# EAGLE design BluetoothAdapter_v2 (EAGLE 8.5.1)
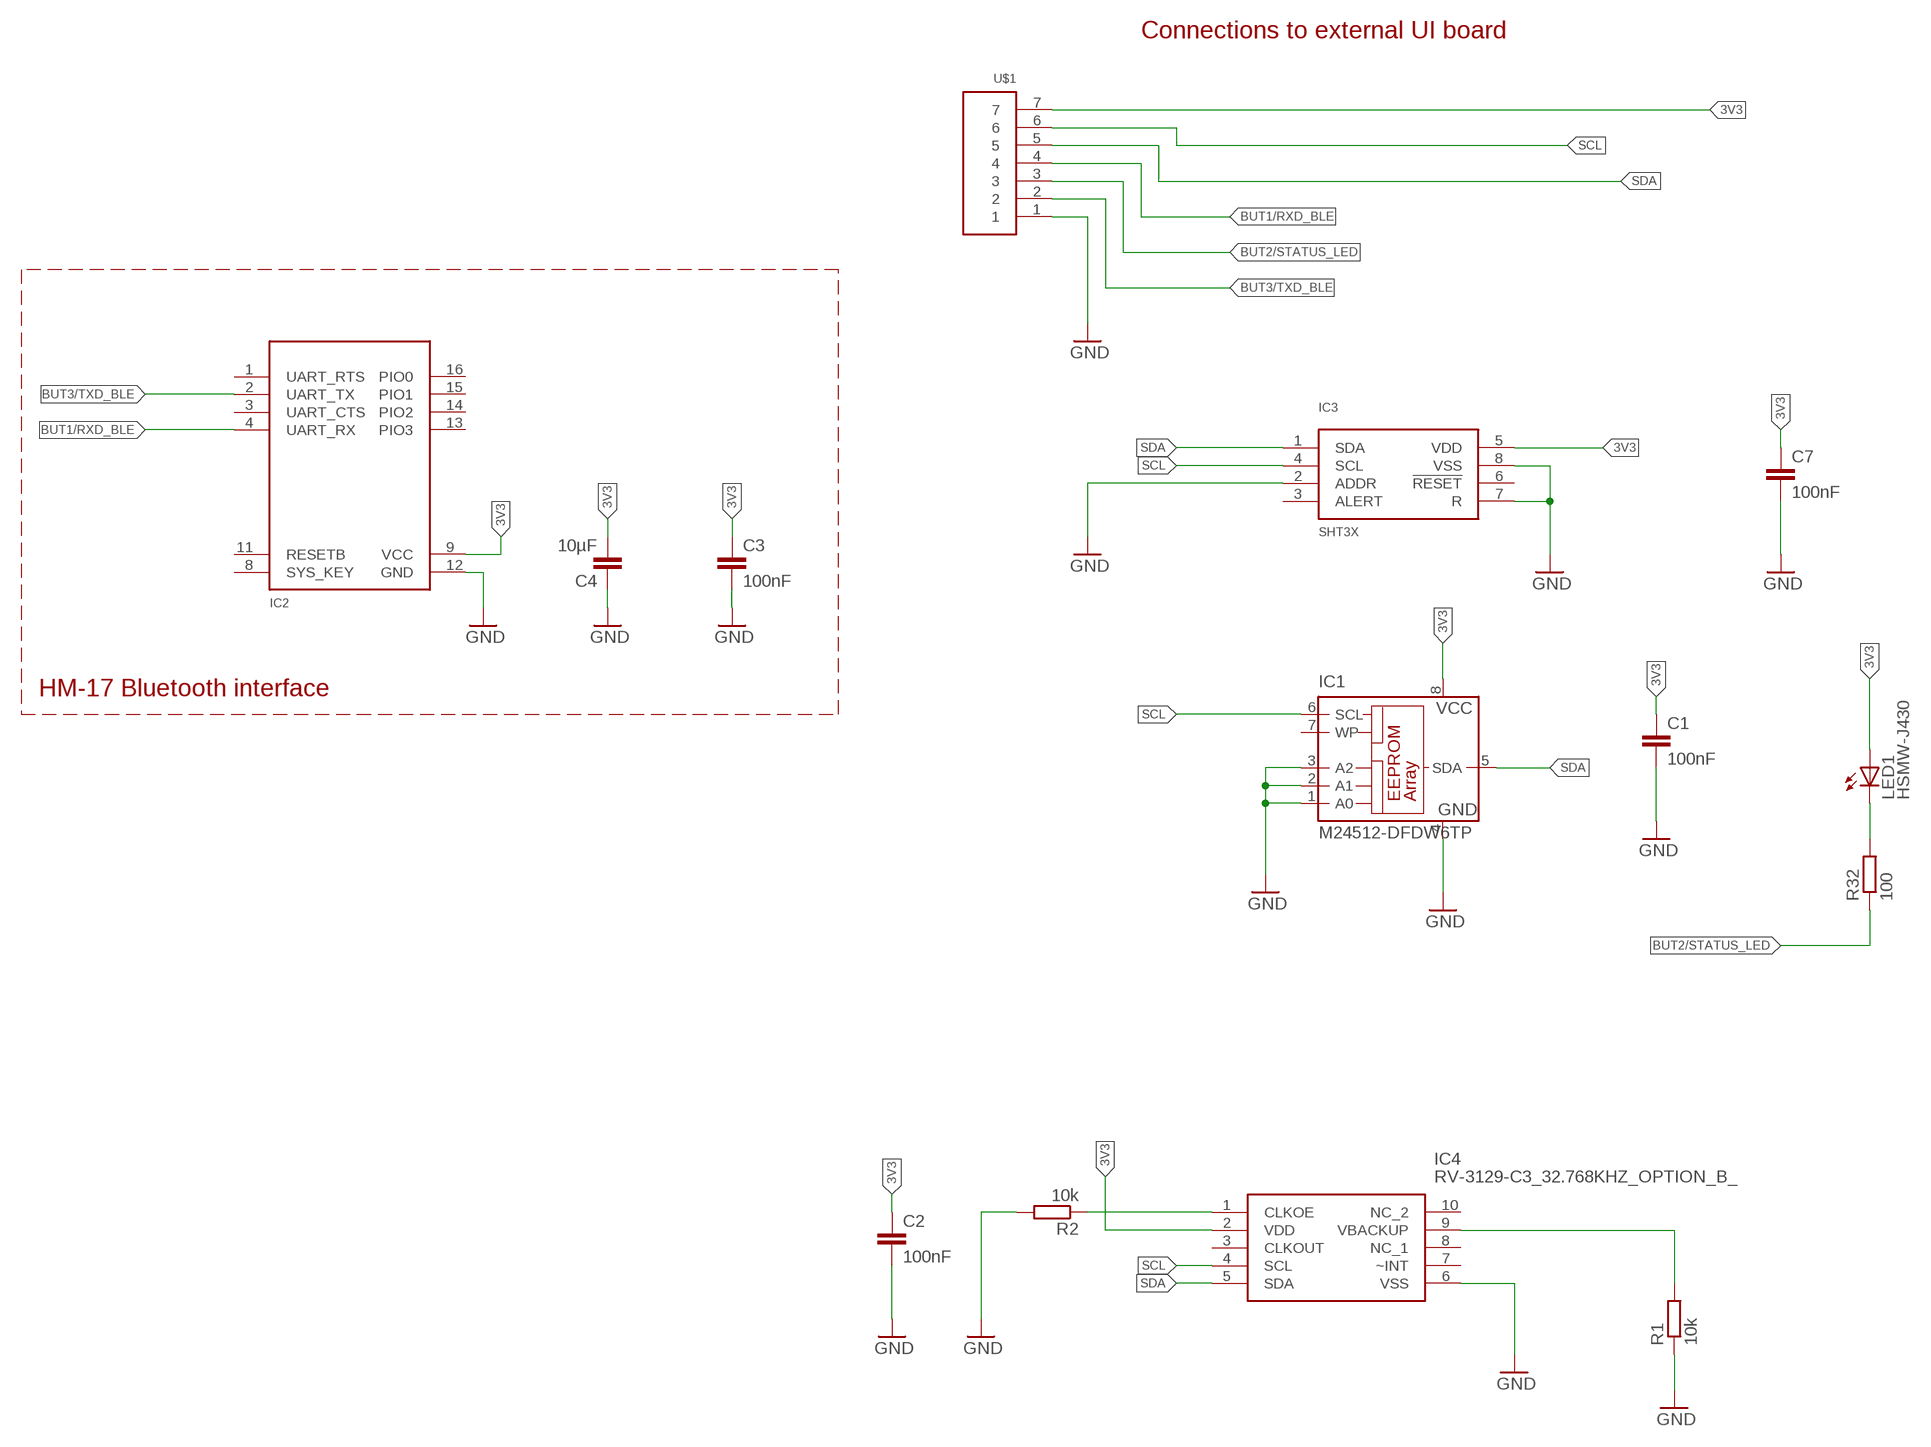
[diagram p0: schematic, sheet 1]

## Parts
C1  100nF  C-EUC0402  [C0402]
C2  100nF  C-EUC0402  [C0402]
C3  100nF  C-EUC0402  [C0402]
C4  10µF  C-EUC0805K  [C0805K]
C7  100nF  C-EUC0402  [C0402]
IC1  M24512-DFDW6TP  24LC128ST  [TSSOP8]
IC2  HM17  [HM17]
IC3  SHT3X  [TDFN8-2.5X2.5MM]
IC4  RV-3129-C3_32.768KHZ_OPTION_B_  [RV3129C3]
LED1  HSMW-J430  LEDSMT1206  [1206]
R1  10k  R-EU_R0603  [R0603]
R2  10k  R-EU_R0603  [R0603]
R32  100  R-EU_R0603  [R0603]
U$1  WIREPAD1X7  [WIREPAD1X7]

## Nets
3V3: C1.1 C2.1 C3.1 C4.2 C7.1 IC1.8(VCC) IC2.9(VCC) IC3.5(VDD) IC4.2(VDD) LED1.A U$1.7
BUT1/RXD_BLE: IC2.4(UART_RX) U$1.4
BUT2/STATUS_LED: R32.1 U$1.3
BUT3/TXD_BLE: IC2.2(UART_TX) U$1.2
GND: C1.2 C2.2 C3.2 C4.1 C7.2 IC1.1(A0) IC1.2(A1) IC1.3(A2) IC1.4(GND) IC2.12(GND) IC3.2(ADDR) IC3.7(R) IC3.8(VSS) IC4.6(VSS) R1.1 R2.2 U$1.1
N$3: IC4.9(VBACKUP) R1.2
N$4: LED1.C R32.2
N$7: IC4.1(CLKOE) R2.1
SCL: IC1.6(SCL) IC3.4(SCL) IC4.4(SCL) U$1.6
SDA: IC1.5(SDA) IC3.1(SDA) IC4.5(SDA) U$1.5
Unconnected: IC1.7(WP) IC2.1(UART_RTS) IC2.3(UART_CTS) IC2.8(SYS_KEY) IC2.11(RESETB) IC2.13(PIO3) IC2.14(PIO2) IC2.15(PIO1) IC2.16(PIO0) IC3.3(ALERT) IC3.6(!RESET) IC4.3(CLKOUT) IC4.7(~INT) IC4.8(NC_1) IC4.10(NC_2)

## Notes on the sheet
- Connections to external UI board
- HM-17 Bluetooth interface

## Library data of the parts
C1-C4 C7 = rcl:C-EU: CAPACITOR, European symbol
IC1 = microchip:24*: Serial EEPROM I2C; MF: MICROCHIP; MPN: 24LC128-I/ST; OC_FARNELL: 1296573; OC_NEWARK: 62K0578
IC2 = HM17Bluetooth:HM17
IC3 = SHT3x:SHT3X
IC4 = SamacSys_Parts:RV-3129-C3_32.768KHZ_OPTION_B_: RV-3129-C3 10-Terminal Ceramic Leadless Chip Carrier [LCC10] Source: Datasheet <https://www.mouser.de/datasheet/2/530/RV_3129_C3-1524928.pdf>; DESCRIPTION: RV-3129-C3 10-Terminal Ceramic Leadless Chip Carrier [LCC10]; HEIGHT: 0.9mm; MANUFACTURER_NAME: Micro Crystal AG; MANUFACTURER_PART_NUMBER: RV-3129-C3 32.768kHz OPTION B TA QC; MOUSER_PART_NUMBER: 428-203634-MG01; MOUSER_PRICE-STOCK: https://www.mouser.co.uk/ProductDetail/Micro-Crystal/RV-3129-C3-32.768kHz-OPTION-B-TA-QC?qs=u16ybLDytRaO5x0LmQ8Ynw%3D%3D
LED1 = led:LED: LED OSRAM: - CHIPLED LG R971, LG N971, LY N971, LG Q971, LY Q971, LO R971, LY R971 LH N974, LH R974 LS Q976, LO Q976, LY Q976 LO Q996 - Hyper CHIPLED LW Q18S LB Q993, LB Q99A, LB R99A - SideLED LS A670, LO A670, LY A670, LG A670, LP A670 LB A673, LV A673, LT A673, LW A673 LH A674 LY A675 LS A676, LA A676, LO A676, LY A676, LW A676 LS A679, LY A679, LG A679 - Hyper Micro SIDELED® LS Y876, LA Y876, LO Y876, LY Y876 LT Y87S - SmartLED LW L88C, LW L88S LB L89C, LB L89S, LG L890 LS L89K, LO L89K, LY L89K LS L896, LA L896, LO L896, LY L896 - TOPLED LS T670, LO T670, LY T670, LG T670, LP T670 LSG T670, LSP T670, LSY T670, LOP T670, LYG T670 LG T671, LOG T671, LSG T671 LB T673, LV T673, LT T673, LW T673 LH T674 LS T676, LA T676, LO T676, LY T676, LB T676, LH T676, LSB T676, LW T676 LB T67C, LV T67C, LT T67C, LS T67K, LO T67K, LY T67K, LW E67C LS E67B, LA E67B, LO E67B, LY E67B, LB E67C, LV E67C, LT E67C LW T67C LS T679, LY T679, LG T679 LS T770, LO T770, LY T770, LG T770, LP T770 LB T773, LV T773, LT T773, LW T773 LH T774 LS E675, LA E675, LY E675, LS T675 LS T776, LA T776, LO T776, LY T776, LB T776 LHGB T686 LT T68C, LB T68C - Hyper Mini TOPLED® LB M676 - Mini TOPLED Santana® LG M470 LS M47K, LO M47K, LY M47K Source: http://www.osram.convergy.de LUXEON: - LUMILED® LXK2-PW12-R00, LXK2-PW12-S00, LXK2-PW14-U00, LXK2-PW14-V00 LXK2-PM12-R00, LXK2-PM12-S00, LXK2-PM14-U00 LXK2-PE12-Q00, LXK2-PE12-R00, LXK2-PE12-S00, LXK2-PE14-T00, LXK2-PE14-U00 LXK2-PB12-K00, LXK2-PB12-L00, LXK2-PB12-M00, LXK2-PB14-N00, LXK2-PB14-P00, LXK2-PB14-Q00 LXK2-PR12-L00, LXK2-PR12-M00, LXK2-PR14-Q00, LXK2-PR14-R00 LXK2-PD12-Q00, LXK2-PD12-R00, LXK2-PD12-S00 LXK2-PH12-R00, LXK2-PH12-S00 LXK2-PL12-P00, LXK2-PL12-Q00, LXK2-PL12-R00 Source: www.luxeon.com KINGBRIGHT: KA-3528ASYC Source: www.kingbright.com
R1 R2 R32 = rcl:R-EU_: RESISTOR, European symbol
U$1 = wirepads:WIREPAD1X7

## Board
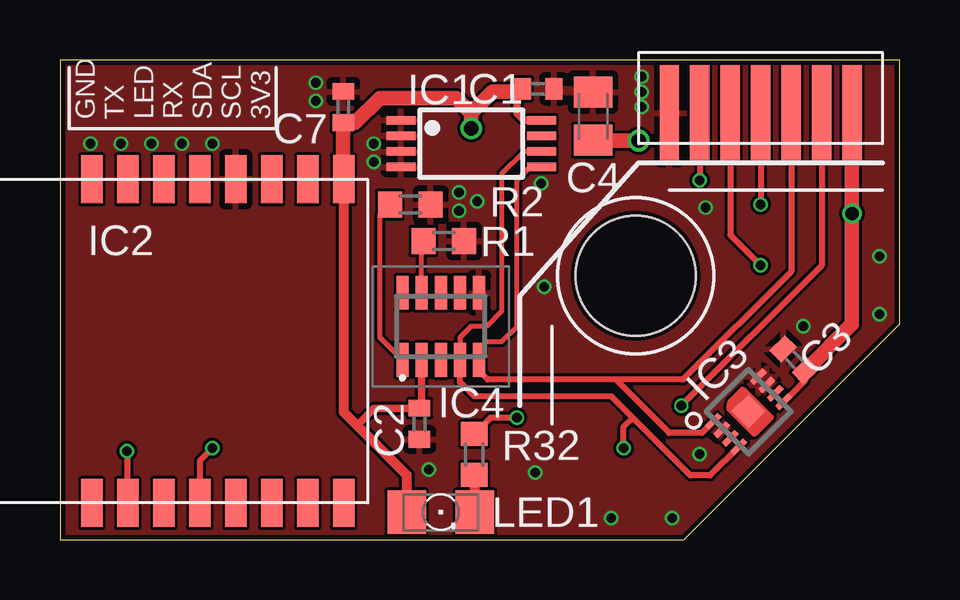
[diagram p1: board, top side]
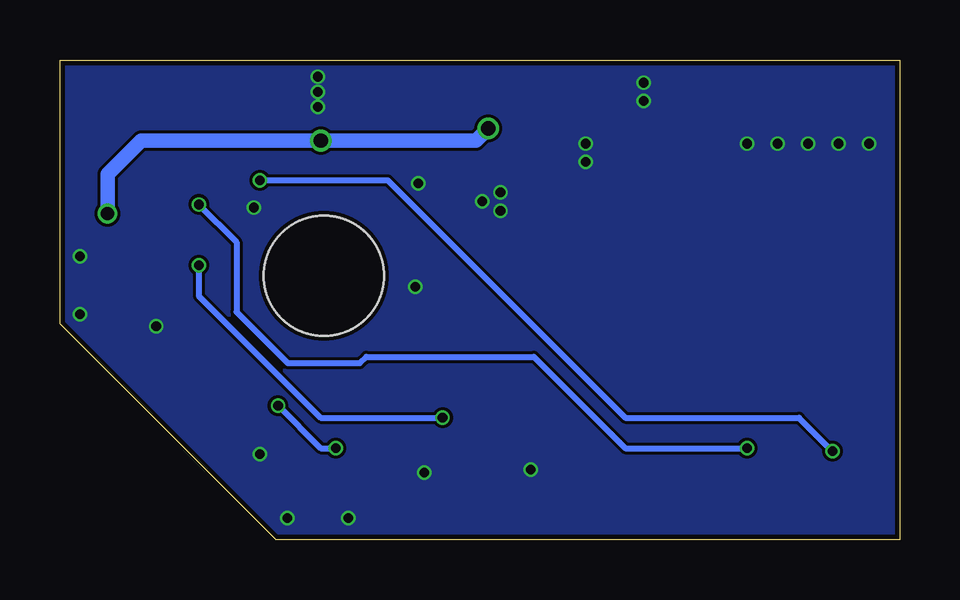
[diagram p2: board, bottom side, seen from below]

Size 35 x 20 mm. Coordinates in mm from the lower left corner, seen from the top.
Outline: 0,20 0,0 26,0 35,9 35,20 0,20
Copper layers (1*16): Top 0.035559375mm / dielectric 1.6mm / Bottom 0.035559375mm
Design rules "jlcpcb2layer": minimum track width 5mil, minimum drill 12mil, track to track 5mil, track to pad 5mil, pad to pad 5mil, via to via 5mil, smd to smd 5mil, copper to edge 8mil, drill to drill 6mil, minimum pad ring 5mil, minimum via ring 3mil, stop-mask expansion 2.5mil, vias tented up to drill 0mil, thermal gap 10mil
Holes 5 mm at 24,11

### Footprints (pad centres in the part's own frame; a part is rotated, then mirrored left to right if it is on the bottom)
C0402 = smd 0.7 x 0.9: 1 -0.65,0; 2 0.65,0
C0805K = smd 1.3 x 1.6: 1 -1,0; 2 1,0
TSSOP8 = smd 0.35 x 1.2: 1 -0.975,-2.925; 2 -0.325,-2.925; 3 0.325,-2.925; 4 0.975,-2.925; 5 0.975,2.925; 6 0.325,2.925; 7 -0.325,2.925; 8 -0.975,2.925
HM17 = smd 2 x 0.9: 1 0,11.5; 2 0,10; 3 0,8.5; 4 0,7; 5 0,5.5; 6 0,4; 7 0,2.5; 8 0,1; 9 13.5,1; 10 13.5,2.5; 11 13.5,4; 12 13.5,5.5; 13 13.5,7; 14 13.5,8.5; 15 13.5,10; 16 13.5,11.5
TDFN8-2.5X2.5MM = smd 0.75 x 0.25: 1 -1.325,0.75; 2 -1.325,0.25; 3 -1.325,-0.25; 4 -1.325,-0.75; 5 1.325,-0.75; 6 1.325,-0.25; 7 1.325,0.25; 8 1.325,0.75 | smd 1 x 1: TH 0,0
RV3129C3 = smd 0.5 x 1.4: 1 -1.6,-1.4; 2 -0.8,-1.4; 3 0,-1.4; 4 0.8,-1.4; 5 1.6,-1.4; 6 1.6,1.4; 7 0.8,1.4; 8 0,1.4; 9 -0.8,1.4; 10 -1.6,1.4
1206 = smd 1.6 x 1.803: A -1.422,0; C 1.422,0
R0603 = smd 1 x 1.1: 1 -0.85,0; 2 0.85,0
WIREPAD1X7 = smd 4 x 0.8: 1 0,3.81; 2 0,2.54; 3 0,1.27; 4 0,0; 5 0,-1.27; 6 0,-2.54; 7 0,-3.81

### Placement (x,y rotation side)
C1  19.94,18.8 0 top
C2  14.99,4.83 270 top
C3  30.61,7.49 135 top
C4  22.23,17.65 270 top
C7  11.81,18.03 90 top
IC1  17.14,16.51 270 top
IC2  12.83,1.52 90 top
IC3  28.7,5.33 45 top
IC4  15.88,8.89 0 top
LED1  15.88,1.14 0 top
R1  16,12.45 180 top
R2  14.61,13.97 0 top
R32  17.27,3.56 270 top
U$1  29.21,17.78 90 top

### Tracks (layer width: path | path; a pad name or v marks a point on that pad's centre or on a via)
3V3  (via drill 0.55, 0.6)
  Top 0.254: IC3.5 31.07,6.64 C3.1
  Top 0.305: IC4.2 15.07,5.57 C2.1 13.1,5.48 12.38,4.76 | IC1.8 19.34,17.48 19.05,17.78 19.05,18.67
  Top 0.406: IC2.9 11.83,5.32 12.38,4.76 14.45,2.69 LED1.A
  Top 0.61: U$1.7 v33.02,13.59 33.02,8.99 C3.1 | IC2.9 11.81,15.04 C7.1 12.3,17.38 13.34,18.41 16.51,18.41 17.14,17.78 | v17.14,17.14 17.14,17.78 | 17.14,17.78 18.03,18.67 19.05,18.67 19.16,18.67 C1.1 | C4.2 22.24,16.64 v24.13,16.64
  Bottom 0.61: v33.02,13.59 33.02,15.24 31.62,16.64 v24.13,16.64 17.65,16.64 v17.14,17.14
BUT1/RXD_BLE  (via drill 0.4)
  Top 0.254: U$1.4 v29.21,13.97 | v6.35,3.81 5.83,3.29 IC2.4
  Bottom 0.254: v29.21,13.97 27.64,12.4 27.64,9.49 25.51,7.36 22.49,7.36 22.23,7.62 15.24,7.62 11.43,3.81 v6.35,3.81
BUT2/STATUS_LED  (via drill 0.4)
  Top 0.254: U$1.3 27.94,12.7 v29.21,11.43 | v19.05,5.08 17.95,5.08 R32.1
  Bottom 0.254: v29.21,11.43 29.21,10.16 24.13,5.08 v19.05,5.08
BUT3/TXD_BLE  (via drill 0.4)
  Top 0.254: U$1.2 v26.67,14.99 | v2.79,3.68 2.79,1.56 IC2.2
  Bottom 0.254: v26.67,14.99 21.34,14.99 11.43,5.08 4.19,5.08 v2.79,3.68
GND  (via drill 0.4)
  other vias: 30.99,8.89 26.67,3.56 10.67,19.05 5.08,16.51 6.35,16.51 10.67,18.29 20.07,14.86 16.64,14.48 24.26,18.67 19.81,2.79 22.99,0.89 25.53,0.89 2.54,16.51 3.81,16.51 1.27,16.51 24.26,19.3 24.26,18.03 20.19,10.54 26.92,13.84 34.16,9.4 34.16,11.81 15.37,2.92 16.64,13.72 17.4,14.1 13.08,16.51 13.08,15.75
  pour Top: 0,20.32 35.56,20.32 35.56,8.89 26.67,0 0,0
  pour Bottom: 0,20.32 35.56,20.32 35.56,8.89 26.67,0 0,0
N$3
  Top 0.203: IC4.9 15.07,12.37 R1.2
N$4
  Top 0.254: LED1.C 17.78,1.14
  Top 0.406: LED1.C 17.3,2.68 R32.2
N$7
  Top 0.203: IC4.1 13.34,8.43 13.34,13.55 R2.1
SCL  (via drill 0.4)
  Top 0.203: IC1.6 19.36,16.18 18.41,15.24 18.41,9.53 17.78,8.89 17.14,8.89 16.68,8.42 16.68,7.62 IC4.4
  Top 0.254: 23.88,5.08 26.29,2.67 27.1,2.67 IC3.4 | U$1.6 31.75,11.43 v25.91,5.59 | v23.5,3.81 23.5,4.7 23.88,5.08 | 23.88,5.08 22.99,5.97 17.27,5.97 16.68,6.57 16.68,7.62
  Bottom 0.254: v25.91,5.59 24.13,3.81 v23.5,3.81
SDA
  Top 0.203: IC4.5 17.48,7.95 17.78,8.26 18.41,8.26 19.05,8.89 19.05,14.99 19.6,15.54 IC1.5
  Top 0.254: IC3.1 26.75,4.45 25.4,4.45 23.18,6.67 | U$1.5 30.48,11.18 25.97,6.67 23.18,6.67 | 23.18,6.67 17.84,6.67 17.48,7.04 IC4.5

### Text on the board
tPlace: GND / TX / LED / RX / SDA / SCL / 3V3
tDocu: AutoDuct BLE / Adapter HW 1.1 / 2022-08-19